# Altium project LTE_GPS_V1.0.PrjPCB
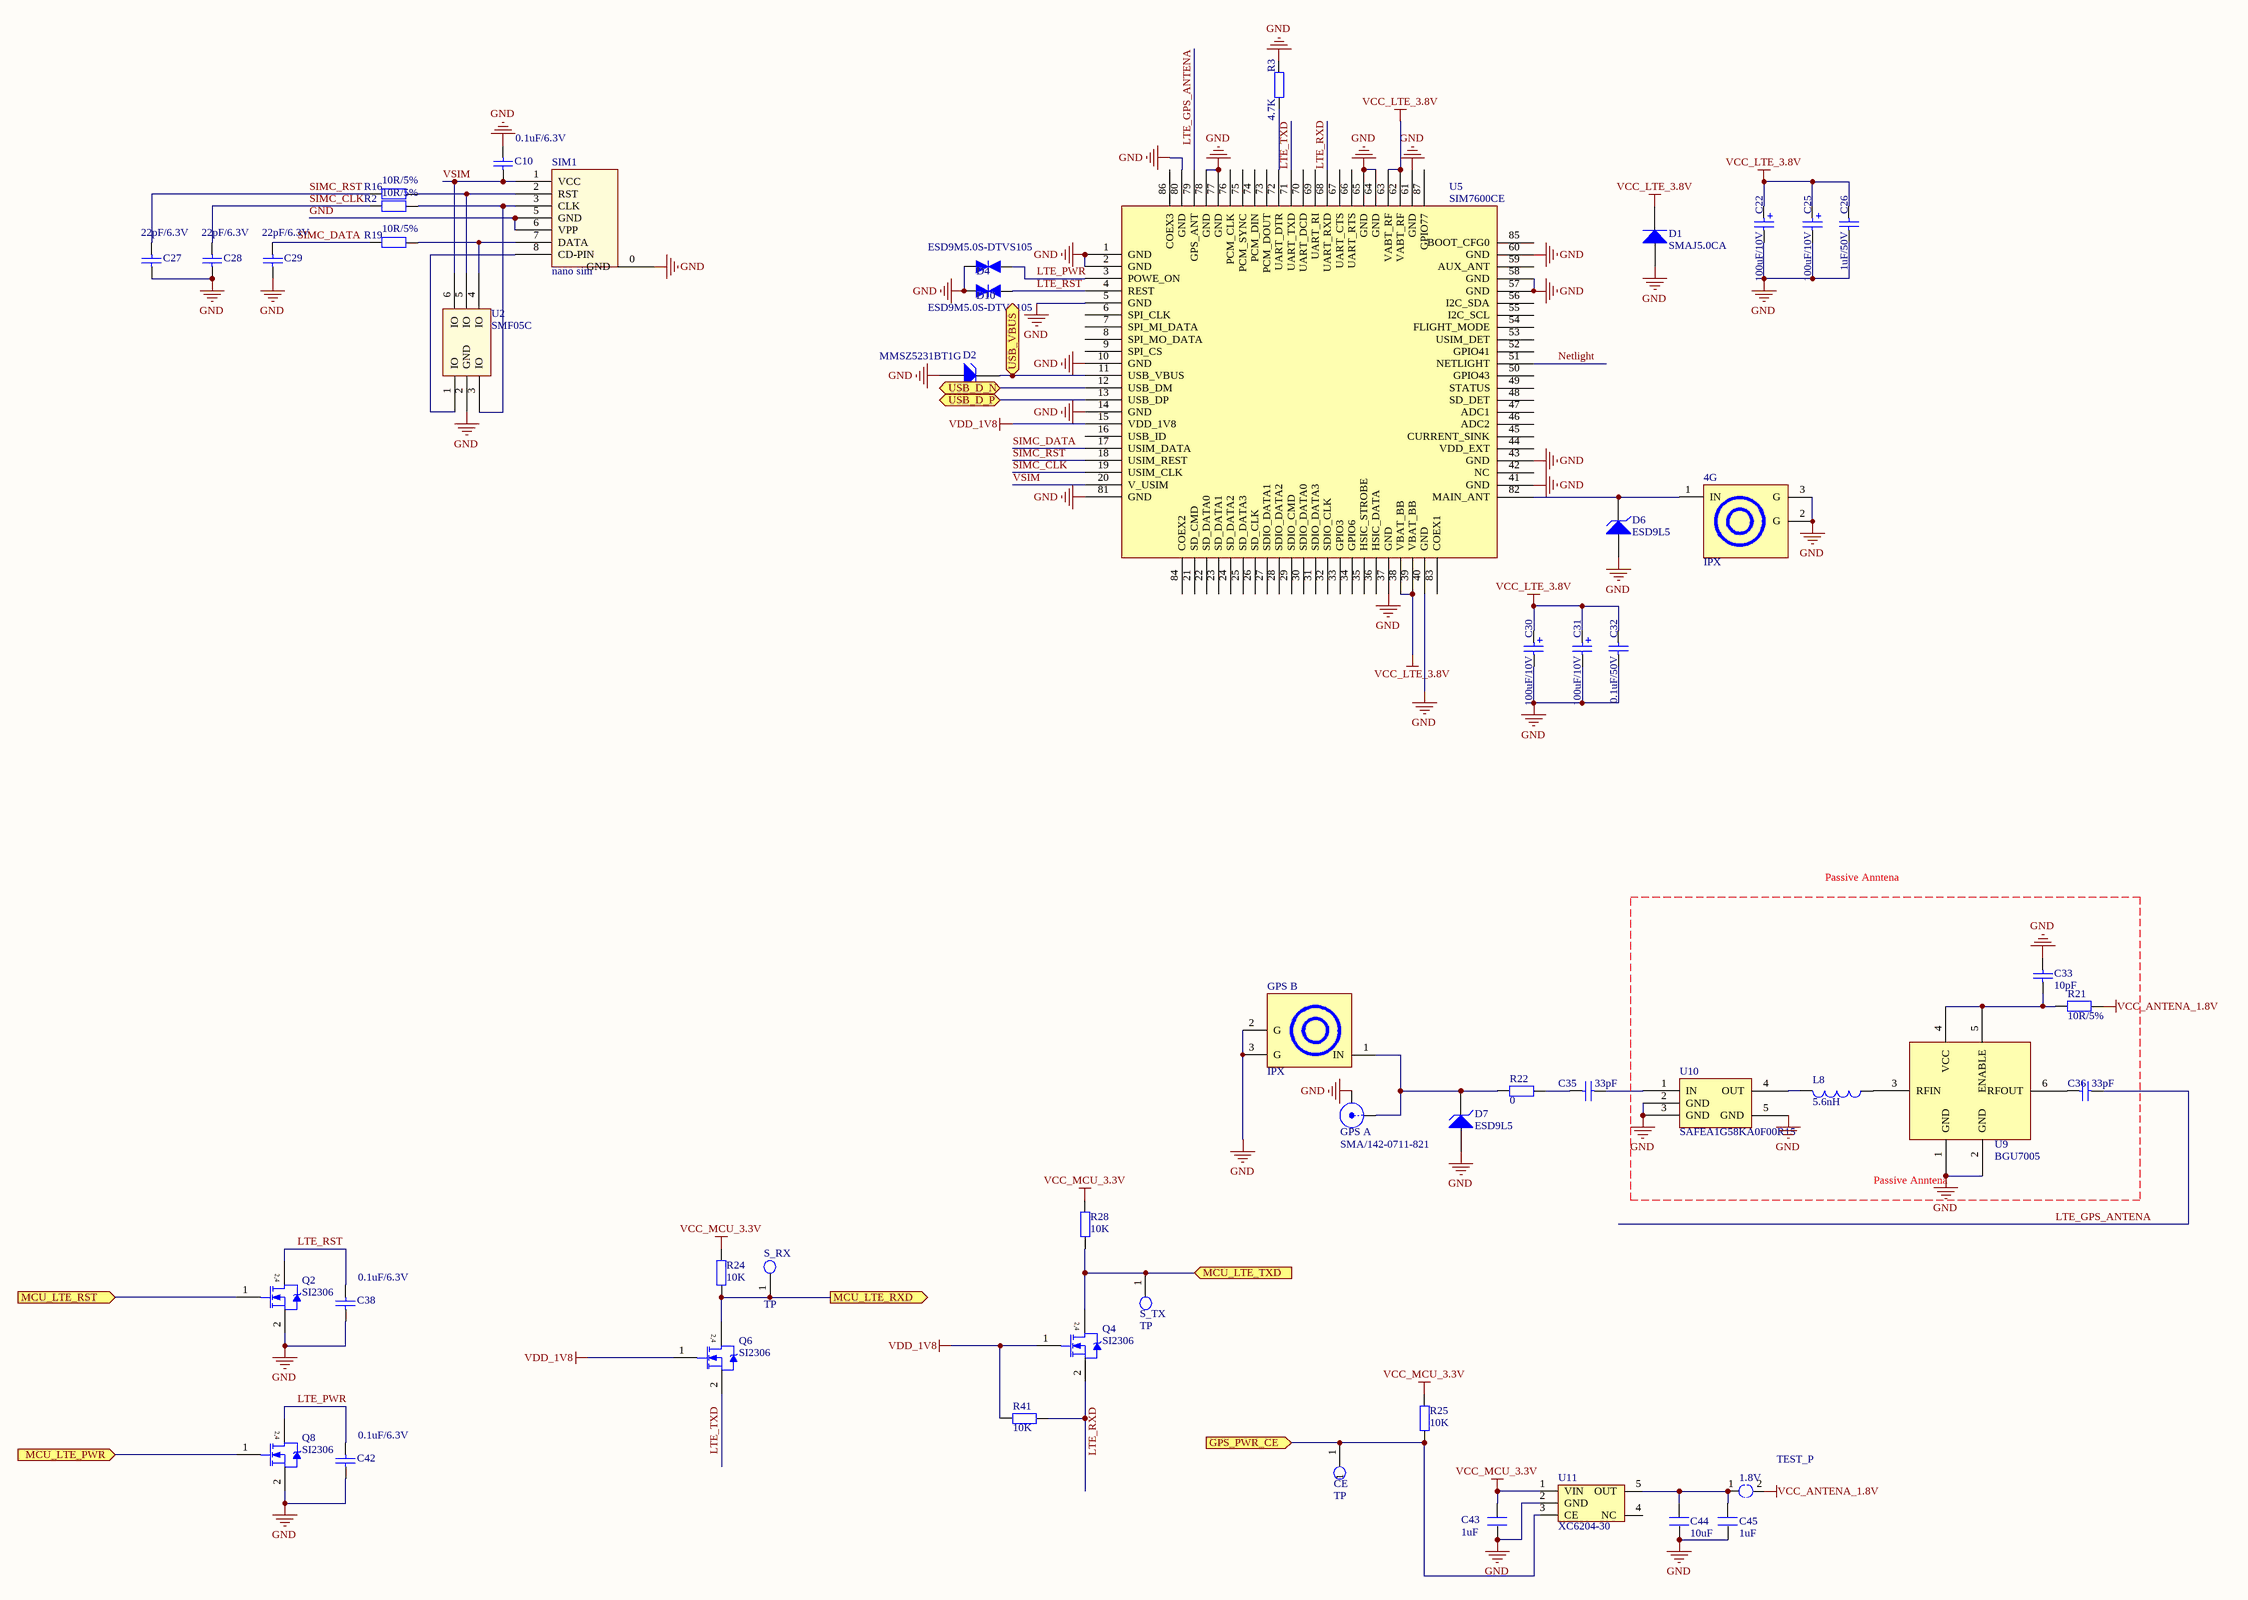
[diagram p0: LTE.SchDoc]
2 sheets, 95 parts. Net scope: global (net labels, ports and power ports of the same name join across sheets).
Board file: LTE_GPS_433_V1.1.PcbDoc
Sheets:
  LTE.SchDoc
  MCU.SchDoc

## Sheet LTE.SchDoc
size A2

### Parts
(Parts that share a designator on the sheet are numbered #1, #2 ... from top to bottom, then left to right.)
1.8V  TEST_P  [TP_High PWR]
4G#1  IPX  [ECT8180001581]
C10  0.1uF/6.3V  [0603C]
C22  100uF/10V  [1210E]
C25  100uF/10V  [1210E]
C26  1uF/50V  [0603C]
C27  22pF/6.3V  [0603C]
C28  22pF/6.3V  [0603C]
C29  22pF/6.3V  [0603C]
C30  100uF/10V  [1210E]
C31  100uF/10V  [1210E]
C32  0.1uF/50V  [0603C]
C33  10pF  [0603C]
C35  33pF  [0603C]
C36  33pF  [0603C]
C38  0.1uF/6.3V  [0603C]
C42  0.1uF/6.3V  [0603C]
C43  1uF  [0603C]
C44  10uF  [0603C]
C45  1uF  [0402C]
CE  TP  [TPD]
D1  SMAJ5.0CA  [SMA]
D2  MMSZ5231BT1G  [SOD123]
D4  ESD9M5.0S-DTVS105  [SOD923]
D6  ESD9L5  [SOD923]
D7  ESD9L5  [SOD923]
D10  ESD9M5.0S-DTVS105  [SOD923]
GPS_A  SMA/142-0711-821  [SMA END LAUNCH JACK RECEPTACLE SHORT]
GPS_B  IPX  [ECT8180001581]
L8  5.6nH  [INDC1005AL]
Q2  SI2306  [SOT23-3]
Q4  SI2306  [SOT23-3]
Q6  SI2306  [SOT23-3]
Q8  SI2306  [SOT23-3]
R2  10R/5%  [0603R]
R3  4.7K  [0603R]
R16  10R/5%  [0603R]
R19  10R/5%  [0603R]
R21  10R/5%  [0603R]
R22  0  [0603R]
R24  10K  [0603R]
R25  10K  [0603R]
R28  10K  [0603R]
R41  10K  [0603R]
S_RX  TP  [TPD]
S_TX  TP  [TPD]
SIM1  nano sim  [Nano SIM]
U2  SMF05C  [SC70-6L]
U5  SIM7600CE  [SIM7600CE]
U9  BGU7005  [BGU7005]
U10  SAFEA1G58KA0F00R15  [SAFEA1G58KA0F00R15]
U11  XC6204-30  [SOT23-5(DBV)]

### Ports
GPS_PWR_CE (in), MCU_LTE_PWR (in), MCU_LTE_RST (in), MCU_LTE_RXD (out), MCU_LTE_TXD (in), USB_D_N, USB_D_P, USB_VBUS (bidir)

### Nets
GND: 4G#1.2(G) 4G#1.3(G) C10.1 C22.2 C25.2 C26.2 C27.2 C28.2 C29.2 C30.2 C31.2 C32.2 C33.2 C38.2 C42.2 C43.1 C44.1 C45.1 D1.1(A) D2.A D4.1(A) D6.A D7.A D10.1(A) GPS_A.2(GND) GPS_B.2(G) GPS_B.3(G) Q2.2(S) Q8.2(S) R3.1 SIM1.0(GND) SIM1.5(GND) SIM1.6(VPP) U2.2(GND) U5.1(GND) U5.2(GND) U5.5(GND) U5.10(GND) U5.14(GND) U5.37(GND) U5.40(GND) U5.41(GND) U5.43(GND) U5.57(GND) U5.58(GND) U5.60(GND) U5.61(GND) U5.64(GND) U5.65(GND) U5.77(GND) U5.78(GND) U5.80(GND) U5.81(GND) U9.1(GND) U9.2(GND) U10.2(GND) U10.3(GND) U10.5(GND) U11.2(GND)
VCC_ANTENA_1.8V: 1.8V.2 R21.2
VCC_LTE_3.8V: C22.1 C25.1 C26.1 C30.1 C31.1 C32.1 D1.2(K) U5.38(VBAT_BB) U5.39(VBAT_BB) U5.62(VABT_RF) U5.63(VABT_RF)
VCC_MCU_3.3V: C43.2 R24.1 R25.2 R28.2 U11.1(VIN)
VDD_1V8: Q4.1(G) Q6.1(G) R41.2 U5.15(VDD_1V8)
LTE_GPS_ANTENA: C36.2 U5.79(GPS_ANT)
LTE_PWR: C42.1 D4.2(K) Q8.3(D) U5.3(POWE_ON)
LTE_RST: C38.1 D10.2(K) Q2.3(D) U5.4(REST)
LTE_RXD: Q4.2(S) R41.1 U5.68(UART_RXD)
LTE_TXD: Q6.2(S) U5.71(UART_TXD)
Netlight: U5.51(NETLIGHT)
SIMC_CLK: C28.1 R2.2 U5.19(USIM_CLK)
SIMC_DATA: C29.1 R19.2 U5.17(USIM_DATA)
SIMC_RST: C27.1 R16.2 U5.18(USIM_REST)
VSIM: C10.2 SIM1.1(VCC) U2.6(IO) U5.20(V_USIM)
Net1.8V_1: 1.8V.1 C44.2 C45.2 U11.5(OUT)
Net4G#1_1: 4G#1.1(IN) D6.K U5.82(MAIN_ANT)
NetC33_1: C33.1 R21.1 U9.4(VCC) U9.5(ENABLE)
NetC35_1: C35.1 R22.2
NetC35_2: C35.2 U10.1(IN)
NetC36_1: C36.1 U9.6(RFOUT)
NetCE_1: CE.1 R25.1 U11.3(CE) ; port GPS_PWR_CE
NetD2_K: D2.K U5.11(USB_VBUS) ; port USB_VBUS
NetD7_K: D7.K GPS_A.1(Signal) GPS_B.1(IN) R22.1
NetL8_1: L8.1 U9.3(RFIN)
NetL8_2: L8.2 U10.4(OUT)
NetQ2_1: Q2.1(G) ; port MCU_LTE_RST
NetQ4_3: Q4.3(D) R28.1 S_TX.1 ; port MCU_LTE_TXD
NetQ6_3: Q6.3(D) R24.2 S_RX.1 ; port MCU_LTE_RXD
NetQ8_1: Q8.1(G) ; port MCU_LTE_PWR
NetR2_1: R2.1 SIM1.3(CLK) U2.3(IO)
NetR3_2: R3.2 U5.72(UART_DTR)
NetR16_1: R16.1 SIM1.2(RST) U2.5(IO)
NetR19_1: R19.1 SIM1.7(DATA) U2.4(IO)
NetR20_2: U5.12(USB_DM) ; port USB_D_N
NetR23_2: U5.13(USB_DP) ; port USB_D_P
NetSIM1_8: SIM1.8(CD-PIN) U2.1(IO)

Not connected (* = marked no-connect by the designer): U5 6(SPI_CLK) 7(SPI_MI_DATA) 8(SPI_MO_DATA) 9(SPI_CS) 16(USB_ID) 21(SD_CMD) 22(SD_DATA0) 23(SD_DATA1) 24(SD_DATA2) 25(SD_DATA3) 26(SD_CLK) 27(SDIO_DATA1) 28(SDIO_DATA2) 29(SDIO_CMD) 30(SDIO_DATA0) 31(SDIO_DATA3) 32(SDIO_CLK) 33(GPIO3) 34(GPIO6) 35(HSIC_STROBE) 36(HSIC_DATA) 42(NC) 44(VDD_EXT) 45(CURRENT_SINK) 46(ADC2) 47(ADC1) 48(SD_DET) 49(STATUS) 50(GPIO43) 52(GPIO41) 53(USIM_DET) 54(FLIGHT_MODE) 55(I2C_SCL) 56(I2C_SDA) 59(AUX_ANT) 66(UART_RTS) 67(UART_CTS) 69(UART_RI) 70(UART_DCD) 73(PCM_DOUT) 74(PCM_DIN) 75(PCM_SYNC) 76(PCM_CLK) 83(COEX1) 84(COEX2) 85(BOOT_CFG0) 86(COEX3) 87(GPIO77); U11 4(NC)

### Notes on the sheet
- Passive Anntena
- (near U9) Passive Anntena
- (in symbol BUK92150-55A) 2,4

### Library data of the parts
4G#1 GPS_B = IPX: MCU; ComponentLink1Description: 供应商链接; ComponentLink1URL: http://www.szlcsc.com/product/details_9202.html; Package: LQFP-44_10x10x08P; Supplier: LC; SuppliersPartNumber: C8696
C10 C26-C29 C32 C33 C35 C36 C38 C42 = Cap: Capacitor; Value: 0.1uF/10V; Published: 8-Jun-2000; LatestRevisionDate: 17-Jul-2002; LatestRevisionNote: Re-released for DXP Platform.; PackageReference: RAD-0.3; Publisher: Altium Limited
C22 C25 C30 C31 = Cap Pol2: Polarized Capacitor (Axial); Value: 220uF/10V; Published: 8-Jun-2000; LatestRevisionDate: 17-Jul-2002; LatestRevisionNote: Re-released for DXP Platform.; PackageReference: POLAR0.8; Publisher: Altium Limited
C43-C45 = C
D1 = Diode: Default Diode; Published: 8-Jun-2000; LatestRevisionDate: 17-Jul-2002; LatestRevisionNote: Re-released for DXP Platform.; PackageVersion: Sep-1996; PackageReference: SMC; Publisher: Altium Limited; Code_JEDEC: DO-214-AB
D2 D6 D7 = D Zener: Zener Diode; Published: 8-Jun-2000; LatestRevisionDate: 17-Jul-2002; LatestRevisionNote: Re-released for DXP Platform.; PackageReference: DIODE-0.7; Publisher: Altium Limited
GPS_A = SMA: SMA Straight Connector; LatestRevisionDate: 05-oct-2007  -  Semtech; LatestRevisionNote: Re-released for DXP Platform.; Publisher: Altium Limited
L8 = Inductor: Code_IEC: 1005; Value: 10mH; Published: 8-Jun-2000; LatestRevisionDate: 29-May-2009; LatestRevisionNote: IPC-7351 Footprint Added.; PackageReference: 0402-A; Publisher: Altium Limited; PackageDescription: Chip Inductor; Code_JEITA: 0402
Q2 Q4 Q6 Q8 = BUK92150-55A: Published: 8-Jun-2000; LatestRevisionDate: 17-Jul-2002; LatestRevisionNote: Re-released for DXP Platform.; DatasheetVersion: 6-Oct-1997; PackageVersion: Aug-1998; PackageReference: TSOP-6; Publisher: Altium Limited; PackageDescription: SOT-457/SC-74; 6 Leads; Body 3.1 x 3 mm, inc. leads (LxW max); ComponentLink1Description: Manufacturer Link; ComponentLink1URL: http://www.vishay.com/; ComponentLink2Description: Datasheet; ComponentLink2URL: http://www.vishay.com/docs/70192/70192.pdf
R2 R3 R16 R19 R21 R22 R24 R25 R28 R41 = Res2: Resistor; Value: 10R; Published: 8-Jun-2000; LatestRevisionDate: 17-Jul-2002; LatestRevisionNote: Re-released for DXP Platform.; PackageReference: AXIAL-0.4; Publisher: Altium Limited
U11 = XC6204

## Sheet MCU.SchDoc
size A2
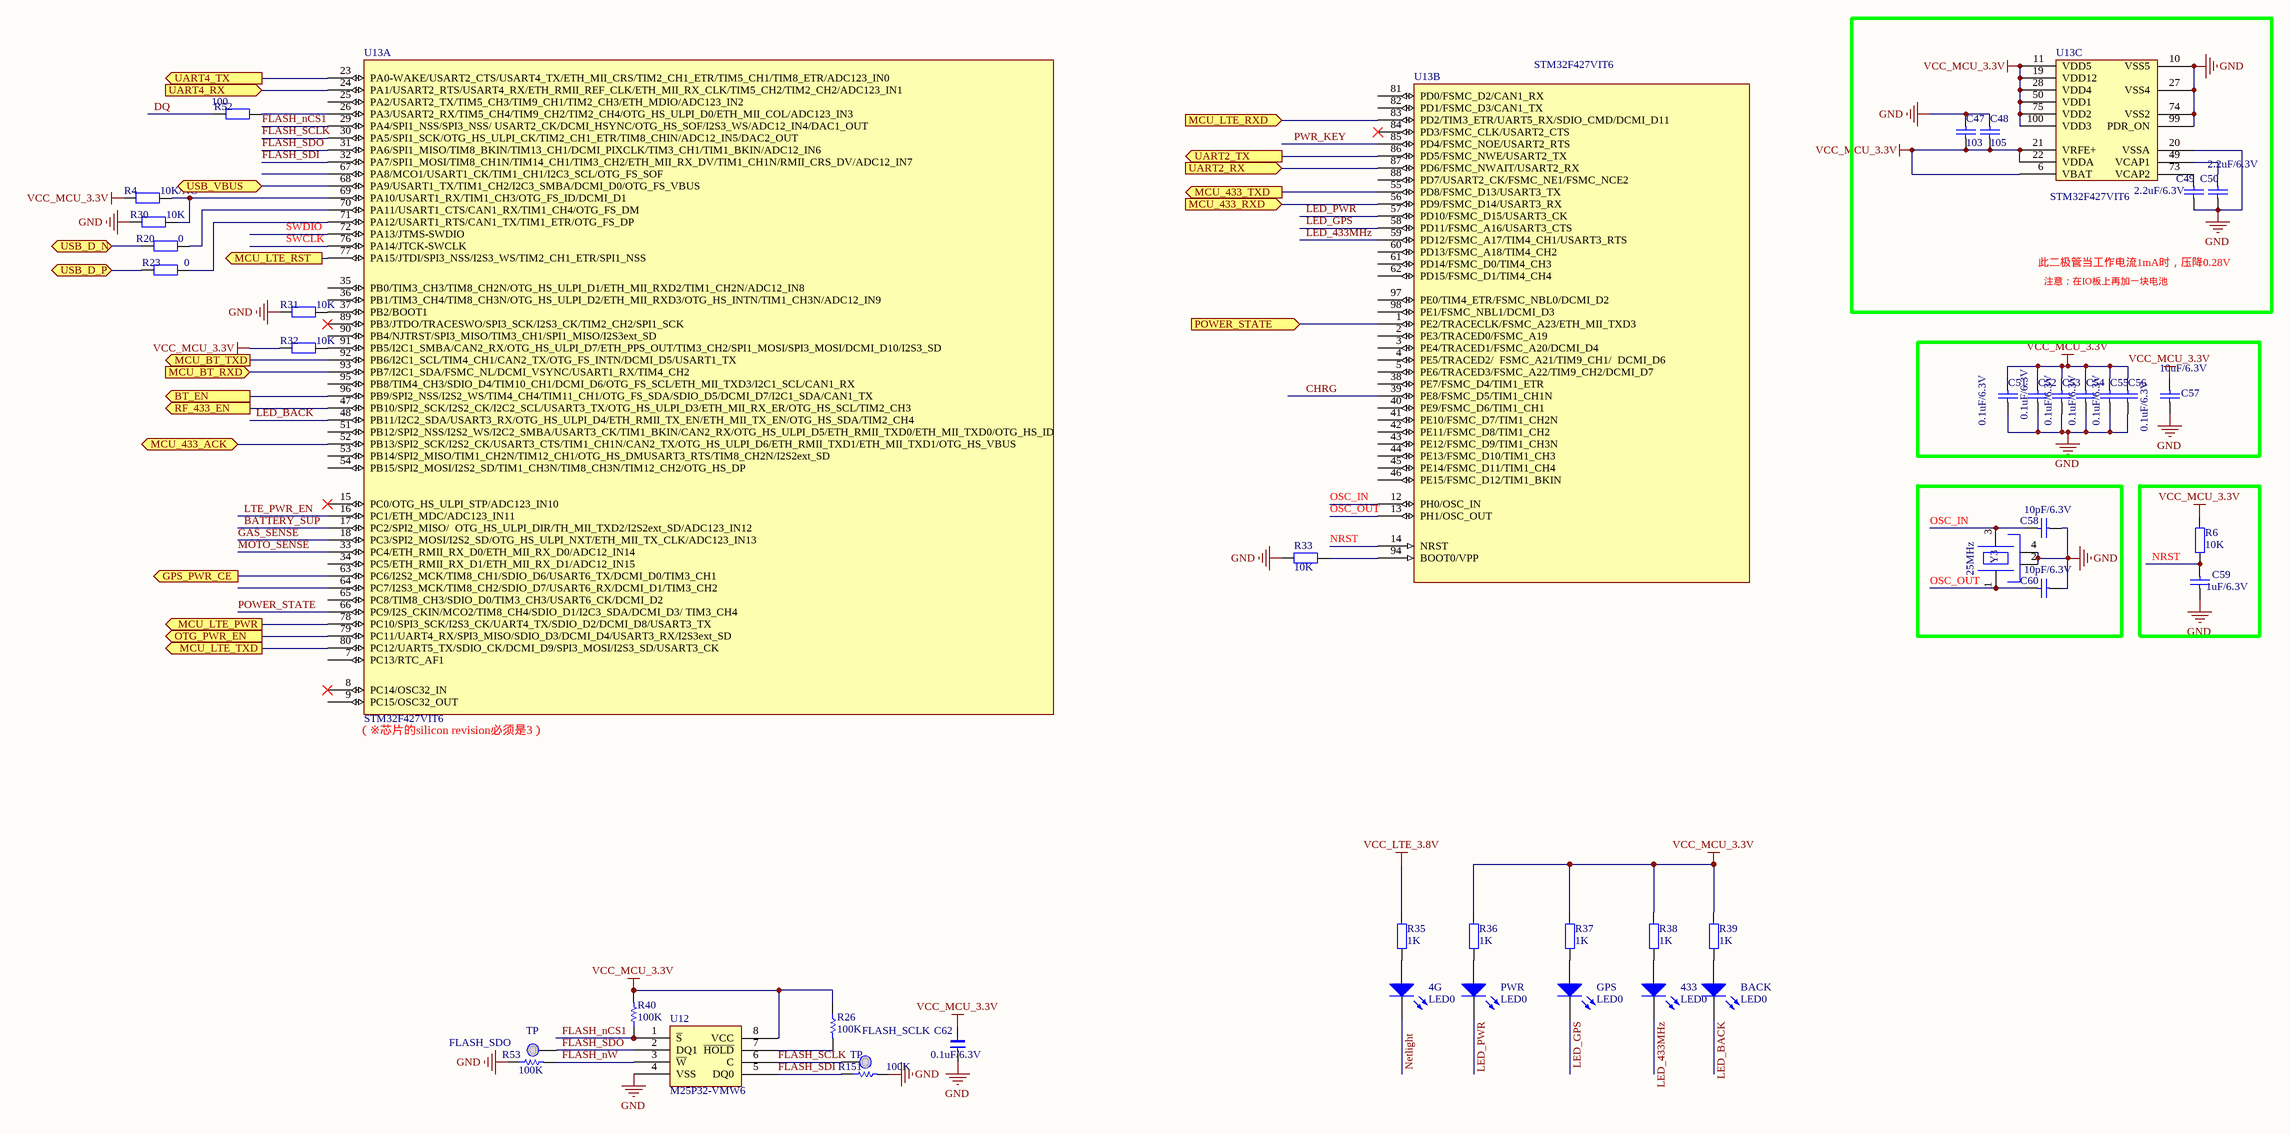
[diagram p1: MCU.SchDoc]

### Parts
(Parts that share a designator on the sheet are numbered #1, #2 ... from top to bottom, then left to right.)
4G#2  LED0  [LED_DIP_3mm]
433  LED0  [LED_DIP_3mm]
BACK  LED0  [LED_DIP_3mm]
C47  103  [0603C]
C48  105  [0603C]
C49  2.2uF/6.3V  [0603C]
C50  2.2uF/6.3V  [0603C]
C51  0.1uF/6.3V  [0603C]
C52  0.1uF/6.3V  [0603C]
C53  0.1uF/6.3V  [0603C]
C54  0.1uF/6.3V  [0603C]
C55  0.1uF/6.3V  [0603C]
C56  0.1uF/6.3V  [0603C]
C57  10uF/6.3V  [0805C]
C58  10pF/6.3V  [0603C]
C59  1uF/6.3V  [0603C]
C60  10pF/6.3V  [0603C]
C62  0.1uF/6.3V  [0603C]
FLASH_SCLK  TP  [tpd]
FLASH_SDO  TP  [tpd]
GPS  LED0  [LED_DIP_3mm]
PWR  LED0  [LED_DIP_3mm]
R4  value 10K/NC  [0603R]  (hidden comment: 10K)
R6  10K  [0603R]
R20  0  [0603R]
R23  0  [0603R]
R26  100K  [0603R]
R30  10K  [0603R]
R31  10K  [0603R]
R32  10K  [0603R]
R33  10K  [0603R]
R35  1K  [0603R]
R36  1K  [0603R]
R37  1K  [0603R]
R38  1K  [0603R]
R39  1K  [0603R]
R40  100K  [0603R]
R52  100  [0603R]
R53  100K  [0603R]
R151  100K  [0603R]
U12  M25P32-VMW6  [SOIC127P790X216-8N]
U13  STM32F427VIT6  [LQFQ100-stm32f103v]  (parts A,B,C of 3)
Y3  25MHz  [OSCILLATOR-3.2X2.5]

### Blocks framed on the sheet
此二极管当工作电流1mA时，压降0.28V: C47-C50 U13

### Ports
BT_EN (out), GPS_PWR_CE (out), MCU_433_ACK (bidir), MCU_433_RXD (in), MCU_433_TXD (out), MCU_BT_RXD (in), MCU_BT_TXD (out), MCU_LTE_PWR (out), MCU_LTE_RST (out), MCU_LTE_RXD (in), MCU_LTE_TXD (out), OTG_PWR_EN (out), POWER_STATE (in), RF_433_EN (out), UART2_RX (in), UART2_TX (out), UART4_RX (in), UART4_TX (out), USB_D_N, USB_D_P, USB_VBUS (bidir)

### Nets
GND: C47.2 C48.2 C49.1 C50.1 C51.1 C52.1 C53.1 C54.1 C55.1 C56.1 C57.2 C58.1 C59.1 C60.1 C62.1 R30.2 R31.2 R33.2 R53.1 R151.2 U12.4(VSS) U13.10(VSS5) U13.20(VSSA) U13.27(VSS4) U13.74(VSS2) U13.99(PDR_ON) Y3.2(GND) Y3.4(GND)
VCC_LTE_3.8V: R35.1
VCC_MCU_3.3V: C47.1 C48.1 C51.2 C52.2 C53.2 C54.2 C55.2 C56.2 C57.1 C62.2 R4.2 R6.2 R26.1 R32.2 R36.1 R37.1 R38.1 R39.1 R40.2 U12.8(VCC) U13.6(VBAT) U13.11(VDD5) U13.19(VDD12) U13.21(VRFE+) U13.22(VDDA) U13.28(VDD4) U13.50(VDD1) U13.75(VDD2) U13.100(VDD3)
BATTERY_SUP: U13.17(PC2/SPI2_MISO/__OTG_HS_ULPI_DIR/TH_MII_TXD2/I2S2ext_SD/ADC123_IN12)
CHRG: U13.39(PE8/FSMC_D5/TIM1_CH1N)
DQ: R52.2
FLASH_nCS1: R40.1 U12.1(~{S}) U13.29(PA4/SPI1_NSS/SPI3_NSS/_USART2_CK/DCMI_HSYNC/OTG_HS_SOF/I2S3_WS/ADC12_IN4/DAC1_OUT)
FLASH_nW: R53.2 U12.3(~{W})
FLASH_SCLK: FLASH_SCLK.1 U12.6(C) U13.30(PA5/SPI1_SCK/OTG_HS_ULPI_CK/TIM2_CH1_ETR/TIM8_CHIN/ADC12_IN5/DAC2_OUT)
FLASH_SDI: R151.1 U12.5(DQ0) U13.32(PA7/SPI1_MOSI/TIM8_CH1N/TIM14_CH1/TIM3_CH2/ETH_MII_RX_DV/TIM1_CH1N/RMII_CRS_DV/ADC12_IN7)
FLASH_SDO: FLASH_SDO.1 U12.2(DQ1) U13.31(PA6/SPI1_MISO/TIM8_BKIN/TIM13_CH1/DCMI_PIXCLK/TIM3_CH1/TIM1_BKIN/ADC12_IN6)
GAS_SENSE: U13.18(PC3/SPI2_MOSI/I2S2_SD/OTG_HS_ULPI_NXT/ETH_MII_TX_CLK/ADC123_IN13)
LED_433MHz: 433.2(K) U13.59(PD12/FSMC_A17/TIM4_CH1/USART3_RTS)
LED_BACK: BACK.2(K) U13.48(PB11/I2C2_SDA/USART3_RX/OTG_HS_ULPI_D4/ETH_RMII_TX_EN/ETH_MII_TX_EN/OTG_HS_SDA/TIM2_CH4)
LED_GPS: GPS.2(K) U13.58(PD11/FSMC_A16/USART3_CTS)
LED_PWR: PWR.2(K) U13.57(PD10/FSMC_D15/USART3_CK)
LTE_PWR_EN: U13.16(PC1/ETH_MDC/ADC123_IN11)
MOTO_SENSE: U13.33(PC4/ETH_RMII_RX_D0/ETH_MII_RX_D0/ADC12_IN14)
Netlight: 4G#2.2(K)
NRST: C59.2 R6.1 U13.14(NRST)
OSC_IN: C58.2 U13.12(PH0/OSC_IN) Y3.3
OSC_OUT: C60.2 U13.13(PH1/OSC_OUT) Y3.1
POWER_STATE: U13.66(PC9/I2S_CKIN/MCO2/TIM8_CH4/SDIO_D1/I2C3_SDA/DCMI_D3/_TIM3_CH4)
PWR_KEY: U13.85(PD4/FSMC_NOE/USART2_RTS)
SWCLK: U13.76(PA14/JTCK-SWCLK)
SWDIO: U13.72(PA13/JTMS-SWDIO)
Net4G#2_1: 4G#2.1(A) R35.2
Net433_1: 433.1(A) R38.2
NetBACK_1: BACK.1(A) R39.2
NetC49_2: C49.2 U13.73(VCAP2)
NetC50_2: C50.2 U13.49(VCAP1)
NetCE_1: U13.63(PC6/I2S2_MCK/TIM8_CH1/SDIO_D6/USART6_TX/DCMI_D0/TIM3_CH1) ; port GPS_PWR_CE
NetD2_K: U13.68(PA9/USART1_TX/TIM1_CH2/I2C3_SMBA/DCMI_D0/OTG_FS_VBUS) ; port USB_VBUS
NetGPS_1: GPS.1(A) R37.2
NetPWR_1: PWR.1(A) R36.2
NetQ2_1: U13.77(PA15/JTDI/SPI3_NSS/I2S3_WS/TIM2_CH1_ETR/SPI1_NSS) ; port MCU_LTE_RST
NetQ4_3: U13.80(PC12/UART5_TX/SDIO_CK/DCMI_D9/SPI3_MOSI/I2S3_SD/USART3_CK) ; port MCU_LTE_TXD
NetQ6_3: U13.83(PD2/TIM3_ETR/UART5_RX/SDIO_CMD/DCMI_D11) ; port MCU_LTE_RXD
NetQ8_1: U13.78(PC10/SPI3_SCK/I2S3_CK/UART4_TX/SDIO_D2/DCMI_D8/USART3_TX) ; port MCU_LTE_PWR
NetR4_1: R4.1 R30.1 U13.69(PA10/USART1_RX/TIM1_CH3/OTG_FS_ID/DCMI_D1)
NetR20_1: R20.1 U13.70(PA11/USART1_CTS/CAN1_RX/TIM1_CH4/OTG_FS_DM)
NetR20_2: R20.2 ; port USB_D_N
NetR23_1: R23.1 U13.71(PA12/USART1_RTS/CAN1_TX/TIM1_ETR/OTG_FS_DP)
NetR23_2: R23.2 ; port USB_D_P
NetR26_2: R26.2 U12.7(~{HOLD})
NetR31_1: R31.1 U13.37(PB2/BOOT1)
NetR32_1: R32.1 U13.91(PB5/I2C1_SMBA/CAN2_RX/OTG_HS_ULPI_D7/ETH_PPS_OUT/TIM3_CH2/SPI1_MOSI/SPI3_MOSI/DCMI_D10/I2S3_SD)
NetR33_1: R33.1 U13.94(BOOT0/VPP)
NetR52_1: R52.1 U13.26(PA3/USART2_RX/TIM5_CH4/TIM9_CH2/TIM2_CH4/OTG_HS_ULPI_D0/ETH_MII_COL/ADC123_IN3)
NetU13_1: U13.1(PE2/TRACECLK/FSMC_A23/ETH_MII_TXD3) ; port POWER_STATE
NetU13_23: U13.23(PA0-WAKE/USART2_CTS/USART4_TX/ETH_MII_CRS/TIM2_CH1_ETR/TIM5_CH1/TIM8_ETR/ADC123_IN0) ; port UART4_TX
NetU13_24: U13.24(PA1/USART2_RTS/USART4_RX/ETH_RMII_REF_CLK/ETH_MII_RX_CLK/TIM5_CH2/TIM2_CH2/ADC123_IN1) ; port UART4_RX
NetU13_47: U13.47(PB10/SPI2_SCK/I2S2_CK/I2C2_SCL/USART3_TX/OTG_HS_ULPI_D3/ETH_MII_RX_ER/OTG_HS_SCL/TIM2_CH3) ; port RF_433_EN
NetU13_52: U13.52(PB13/SPI2_SCK/I2S2_CK/USART3_CTS/TIM1_CH1N/CAN2_TX/OTG_HS_ULPI_D6/ETH_RMII_TXD1/ETH_MII_TXD1/OTG_HS_VBUS) ; port MCU_433_ACK
NetU13_55: U13.55(PD8/FSMC_D13/USART3_TX) ; port MCU_433_TXD
NetU13_56: U13.56(PD9/FSMC_D14/USART3_RX) ; port MCU_433_RXD
NetU13_79: U13.79(PC11/UART4_RX/SPI3_MISO/SDIO_D3/DCMI_D4/USART3_RX/I2S3ext_SD) ; port OTG_PWR_EN
NetU13_86: U13.86(PD5/FSMC_NWE/USART2_TX) ; port UART2_TX
NetU13_87: U13.87(PD6/FSMC_NWAIT/USART2_RX) ; port UART2_RX
NetU13_92: U13.92(PB6/I2C1_SCL/TIM4_CH1/CAN2_TX/OTG_FS_INTN/DCMI_D5/USART1_TX) ; port MCU_BT_TXD
NetU13_93: U13.93(PB7/I2C1_SDA/FSMC_NL/DCMI_VSYNC/USART1_RX/TIM4_CH2) ; port MCU_BT_RXD
NetU13_96: U13.96(PB9/SPI2_NSS/I2S2_WS/TIM4_CH4/TIM11_CH1/OTG_FS_SDA/SDIO_D5/DCMI_D7/I2C1_SDA/CAN1_TX) ; port BT_EN

Not connected (* = marked no-connect by the designer): U13 2(PE3/TRACED0/FSMC_A19) 3(PE4/TRACED1/FSMC_A20/DCMI_D4) 4(PE5/TRACED2/__FSMC_A21/TIM9_CH1/__DCMI_D6) 5(PE6/TRACED3/FSMC_A22/TIM9_CH2/DCMI_D7) 7(PC13/RTC_AF1) 8(PC14/OSC32_IN)* 9(PC15/OSC32_OUT) 15(PC0/OTG_HS_ULPI_STP/ADC123_IN10)* 25(PA2/USART2_TX/TIM5_CH3/TIM9_CH1/TIM2_CH3/ETH_MDIO/ADC123_IN2) 34(PC5/ETH_RMII_RX_D1/ETH_MII_RX_D1/ADC12_IN15) 35(PB0/TIM3_CH3/TIM8_CH2N/OTG_HS_ULPI_D1/ETH_MII_RXD2/TIM1_CH2N/ADC12_IN8) 36(PB1/TIM3_CH4/TIM8_CH3N/OTG_HS_ULPI_D2/ETH_MII_RXD3/OTG_HS_INTN/TIM1_CH3N/ADC12_IN9) 38(PE7/FSMC_D4/TIM1_ETR) 40(PE9/FSMC_D6/TIM1_CH1) 41(PE10/FSMC_D7/TIM1_CH2N) 42(PE11/FSMC_D8/TIM1_CH2) 43(PE12/FSMC_D9/TIM1_CH3N) 44(PE13/FSMC_D10/TIM1_CH3) 45(PE14/FSMC_D11/TIM1_CH4) 46(PE15/FSMC_D12/TIM1_BKIN) 51(PB12/SPI2_NSS/I2S2_WS/I2C2_SMBA/USART3_CK/TIM1_BKIN/CAN2_RX/OTG_HS_ULPI_D5/ETH_RMII_TXD0/ETH_MII_TXD0/OTG_HS_ID) 53(PB14/SPI2_MISO/TIM1_CH2N/TIM12_CH1/OTG_HS_DMUSART3_RTS/TIM8_CH2N/I2S2ext_SD) 54(PB15/SPI2_MOSI/I2S2_SD/TIM1_CH3N/TIM8_CH3N/TIM12_CH2/OTG_HS_DP) 60(PD13/FSMC_A18/TIM4_CH2) 61(PD14/FSMC_D0/TIM4_CH3) 62(PD15/FSMC_D1/TIM4_CH4) 64(PC7/I2S3_MCK/TIM8_CH2/SDIO_D7/USART6_RX/DCMI_D1/TIM3_CH2) 65(PC8/TIM8_CH3/SDIO_D0/TIM3_CH3/USART6_CK/DCMI_D2) 67(PA8/MCO1/USART1_CK/TIM1_CH1/I2C3_SCL/OTG_FS_SOF) 81(PD0/FSMC_D2/CAN1_RX) 82(PD1/FSMC_D3/CAN1_TX) 84(PD3/FSMC_CLK/USART2_CTS)* 88(PD7/USART2_CK/FSMC_NE1/FSMC_NCE2) 89(PB3/JTDO/TRACESWO/SPI3_SCK/I2S3_CK/TIM2_CH2/SPI1_SCK)* 90(PB4/NJTRST/SPI3_MISO/TIM3_CH1/SPI1_MISO/I2S3ext_SD) 95(PB8/TIM4_CH3/SDIO_D4/TIM10_CH1/DCMI_D6/OTG_FS_SCL/ETH_MII_TXD3/I2C1_SCL/CAN1_RX) 97(PE0/TIM4_ETR/FSMC_NBL0/DCMI_D2) 98(PE1/FSMC_NBL1/DCMI_D3)

### Notes on the sheet
- 注意：在IO板上再加一块电池
- (near U13) （※芯片的silicon revision必须是3）

### Library data of the parts
4G#2 433 BACK GPS PWR = LED0: Typical INFRARED GaAs LED; Published: 8-Jun-2000; LatestRevisionDate: 08-Jul-2005; LatestRevisionNote: Mech Layer 1 removed.; PackageReference: LED-0; Publisher: Altium Limited
C47 C48 = Cap: Capacitor; Published: 8-Jun-2000; LatestRevisionDate: 17-Jul-2002; LatestRevisionNote: Re-released for DXP Platform.; PackageReference: RAD-0.3; Publisher: Altium Limited
  C47: Value: 103
  C48: Value: 105
C49 C50 = Cap: Capacitor; Value: 2.2uF; Published: 8-Jun-2000; LatestRevisionDate: 17-Jul-2002; LatestRevisionNote: Re-released for DXP Platform.; PackageReference: RAD-0.3; Publisher: Altium Limited
C51-C56 = Cap: Capacitor; Value: 104; Published: 8-Jun-2000; LatestRevisionDate: 17-Jul-2002; LatestRevisionNote: Re-released for DXP Platform.; PackageReference: RAD-0.3; Publisher: Altium Limited
C57 = Cap: Capacitor; Value: 106; Published: 8-Jun-2000; LatestRevisionDate: 17-Jul-2002; LatestRevisionNote: Re-released for DXP Platform.; PackageReference: RAD-0.3; Publisher: Altium Limited
C58 C60 = Cap: Capacitor; Value: 10pF; Published: 8-Jun-2000; LatestRevisionDate: 17-Jul-2002; LatestRevisionNote: Re-released for DXP Platform.; PackageReference: RAD-0.3; Publisher: Altium Limited
C59 = Cap: Capacitor; Value: 105; Published: 8-Jun-2000; LatestRevisionDate: 17-Jul-2002; LatestRevisionNote: Re-released for DXP Platform.; PackageReference: RAD-0.3; Publisher: Altium Limited
C62 = C
R4 R6 R30-R33 R35-R39 = Res2: Resistor; Published: 8-Jun-2000; LatestRevisionDate: 17-Jul-2002; LatestRevisionNote: Re-released for DXP Platform.; PackageReference: AXIAL-0.4; Publisher: Altium Limited
  R6 R30-R33: Value: 10K
  R35-R39: Value: 1K
R20 R23 R52 = Res2: Resistor; Value: 10K; Published: 8-Jun-2000; LatestRevisionDate: 17-Jul-2002; LatestRevisionNote: Re-released for DXP Platform.; PackageReference: AXIAL-0.4; Publisher: Altium Limited
R26 R40 R53 R151 = Res1: Resistor; Published: 8-Jun-2000; LatestRevisionDate: 17-Jul-2002; LatestRevisionNote: Re-released for DXP Platform.; PackageReference: AXIAL-0.3; Publisher: Altium Limited
U12 = M25P16-VMN6TPBA
U13 = STM32F407VGT6
Y3 = XTAL3

## Nets that join several sheets
GND: LTE (59 pins), MCU (28 pins)
VCC_LTE_3.8V: LTE (11 pins), MCU (R35.1)
VCC_MCU_3.3V: LTE (5 pins), MCU (29 pins)
NetCE_1: LTE (CE.1 R25.1 U11.3), MCU (U13.63)
NetD2_K: LTE (D2.K U5.11), MCU (U13.68)
Netlight: LTE (U5.51), MCU (4G#2.2)
NetQ2_1: LTE (Q2.1), MCU (U13.77)
NetQ4_3: LTE (Q4.3 R28.1 S_TX.1), MCU (U13.80)
NetQ6_3: LTE (Q6.3 R24.2 S_RX.1), MCU (U13.83)
NetQ8_1: LTE (Q8.1), MCU (U13.78)
NetR20_2: LTE (U5.12), MCU (R20.2)
NetR23_2: LTE (U5.13), MCU (R23.2)